# EAGLE schematic POWER-12V5V (EAGLE 9.4.2)
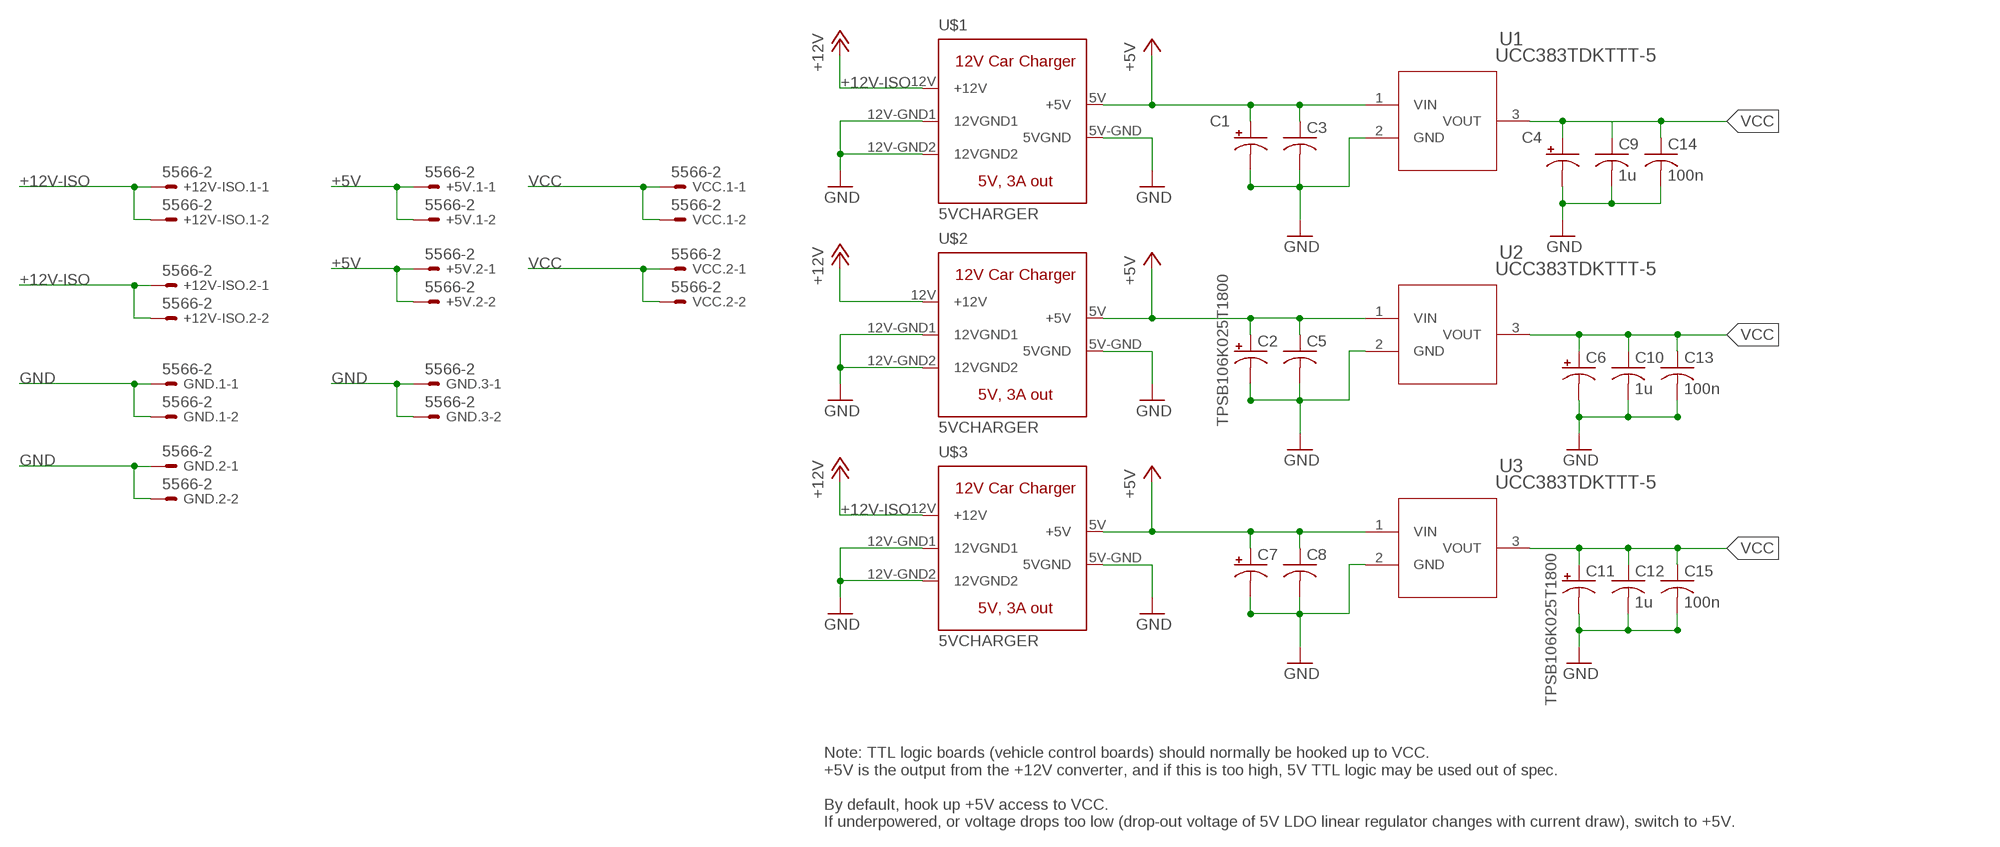
[diagram p0: schematic, sheet 1]

## Parts
+5V.1  5566-2  [5566-2]
+5V.2  5566-2  [5566-2]
+12V-ISO.1  5566-2  [5566-2]
+12V-ISO.2  5566-2  [5566-2]
C1  TPSB106K025T1800  [DIONM3528X210N]
C2  TPSB106K025T1800  [DIONM3528X210N]
C3  C-USC0805  [C0805]
C4  TPSB106K025T1800  [DIONM3528X210N]
C5  C-USC0805  [C0805]
C6  TPSB106K025T1800  [DIONM3528X210N]
C7  TPSB106K025T1800  [DIONM3528X210N]
C8  C-USC0805  [C0805]
C9  1u  C-USC0805  [C0805]
C10  1u  C-USC0805  [C0805]
C11  TPSB106K025T1800  [DIONM3528X210N]
C12  1u  C-USC0805  [C0805]
C13  100n  C-USC0805  [C0805]
C14  100n  C-USC0805  [C0805]
C15  100n  C-USC0805  [C0805]
GND.1  5566-2  [5566-2]
GND.2  5566-2  [5566-2]
GND.3  5566-2  [5566-2]
U1  UCC383TDKTTT-5  [TO263-3]
U2  UCC383TDKTTT-5  [TO263-3]
U3  UCC383TDKTTT-5  [TO263-3]
U$1  5VCHARGER  [5VCHARGER]
U$2  5VCHARGER  [5VCHARGER]
U$3  5VCHARGER  [5VCHARGER]
VCC.1  5566-2  [5566-2]
VCC.2  5566-2  [5566-2]

## Nets
+5V: +5V.1.1 +5V.1.2 +5V.2.1 +5V.2.2 C1.1(+) C2.1(+) C3.1 C5.1 C7.1(+) C8.1 U1.1(VIN) U2.1(VIN) U3.1(VIN) U$1.5V(+5V) U$2.5V(+5V) U$3.5V(+5V)
+12V-ISO: +12V-ISO.1.1 +12V-ISO.1.2 +12V-ISO.2.1 +12V-ISO.2.2 U$1.12V(+12V) U$2.12V(+12V) U$3.12V(+12V) ; supply symbol labelled +12V
GND: C1.2(-) C2.2(-) C3.2 C4.2(-) C5.2 C6.2(-) C7.2(-) C8.2 C9.2 C10.2 C11.2(-) C12.2 C13.2 C14.2 C15.2 GND.1.1 GND.1.2 GND.2.1 GND.2.2 GND.3.1 GND.3.2 U1.2(GND) U2.2(GND) U3.2(GND) U$1.5V-GND(5VGND) U$1.12V-GND1(12VGND1) U$1.12V-GND2(12VGND2) U$2.5V-GND(5VGND) U$2.12V-GND1(12VGND1) U$2.12V-GND2(12VGND2) U$3.5V-GND(5VGND) U$3.12V-GND1(12VGND1) U$3.12V-GND2(12VGND2)
VCC: C4.1(+) C6.1(+) C9.1 C10.1 C11.1(+) C12.1 C13.1 C14.1 C15.1 U1.3(VOUT) U2.3(VOUT) U3.3(VOUT) VCC.1.1 VCC.1.2 VCC.2.1 VCC.2.2

## Notes on the sheet
- Note: TTL logic boards (vehicle control boards) should normally be hooked up to VCC.
  +5V is the output from the +12V converter, and if this is too high, 5V TTL logic may be used out of spec.
  
  By default, hook up +5V access to VCC.
  If underpowered, or voltage drops too low (drop-out voltage of 5V LDO linear regulator changes with current draw), switch to +5V.

## Library data of the parts
+5V.1 +5V.2 +12V-ISO.1 +12V-ISO.2 GND.1-GND.3 VCC.1 VCC.2 = con-molex:5566-2: Mini FIT connector 2 pol Source: http://www.molex.com; MF: MOLEX; OC_FARNELL: 1822072; OC_NEWARK: unknown
C1 C2 C4 C6 C7 C11 = TPSB106K025T1800:TPSB106K025T1800: Tantalum Capacitors - Solid SMD 25V 10uF 10% ESR=1800Ohm AEC-Q200 Source: Datasheet <https://componentsearchengine.com/Datasheets/1/TPSB106K025T1800.pdf>; DESCRIPTION: Tantalum Capacitors - Solid SMD 25V 10uF 10% ESR=1800Ohm AEC-Q200; HEIGHT: 2.1mm; MANUFACTURER_NAME: AVX; MANUFACTURER_PART_NUMBER: TPSB106K025T1800; MOUSER_PART_NUMBER: 581-TPSB106K025T1800; MOUSER_PRICE-STOCK: https://www.mouser.com/Search/Refine.aspx?Keyword=581-TPSB106K025T1800
C3 C5 C8-C10 C12-C15 = rcl:C-US: CAPACITOR, American symbol; SPICEPREFIX: C
U1-U3 = IowaFormula:UCC383TDKTTT-5
U$1-U$3 = IowaFormula:5VCHARGER